# Altium schematic sheet 1_P1.schdoc.schdoc
size 309 x 223 mm; Symbol: Sheet-Symbol_A4; Device: Sheet-Symbol_A4; @Project Name: modula_2024; @Page Count: 1; @Update Date: 2024-04-04; @Create Date: 2024-04-02; @Schematic Name: Schematic1; @Page No: 1; @Page Name: P1; Company: EasyEDA.com; Reviewed: EasyEDA; Version: V0.1; Page Size: A4; Part Number: JLCPCB-002; Drawn: EasyEDA
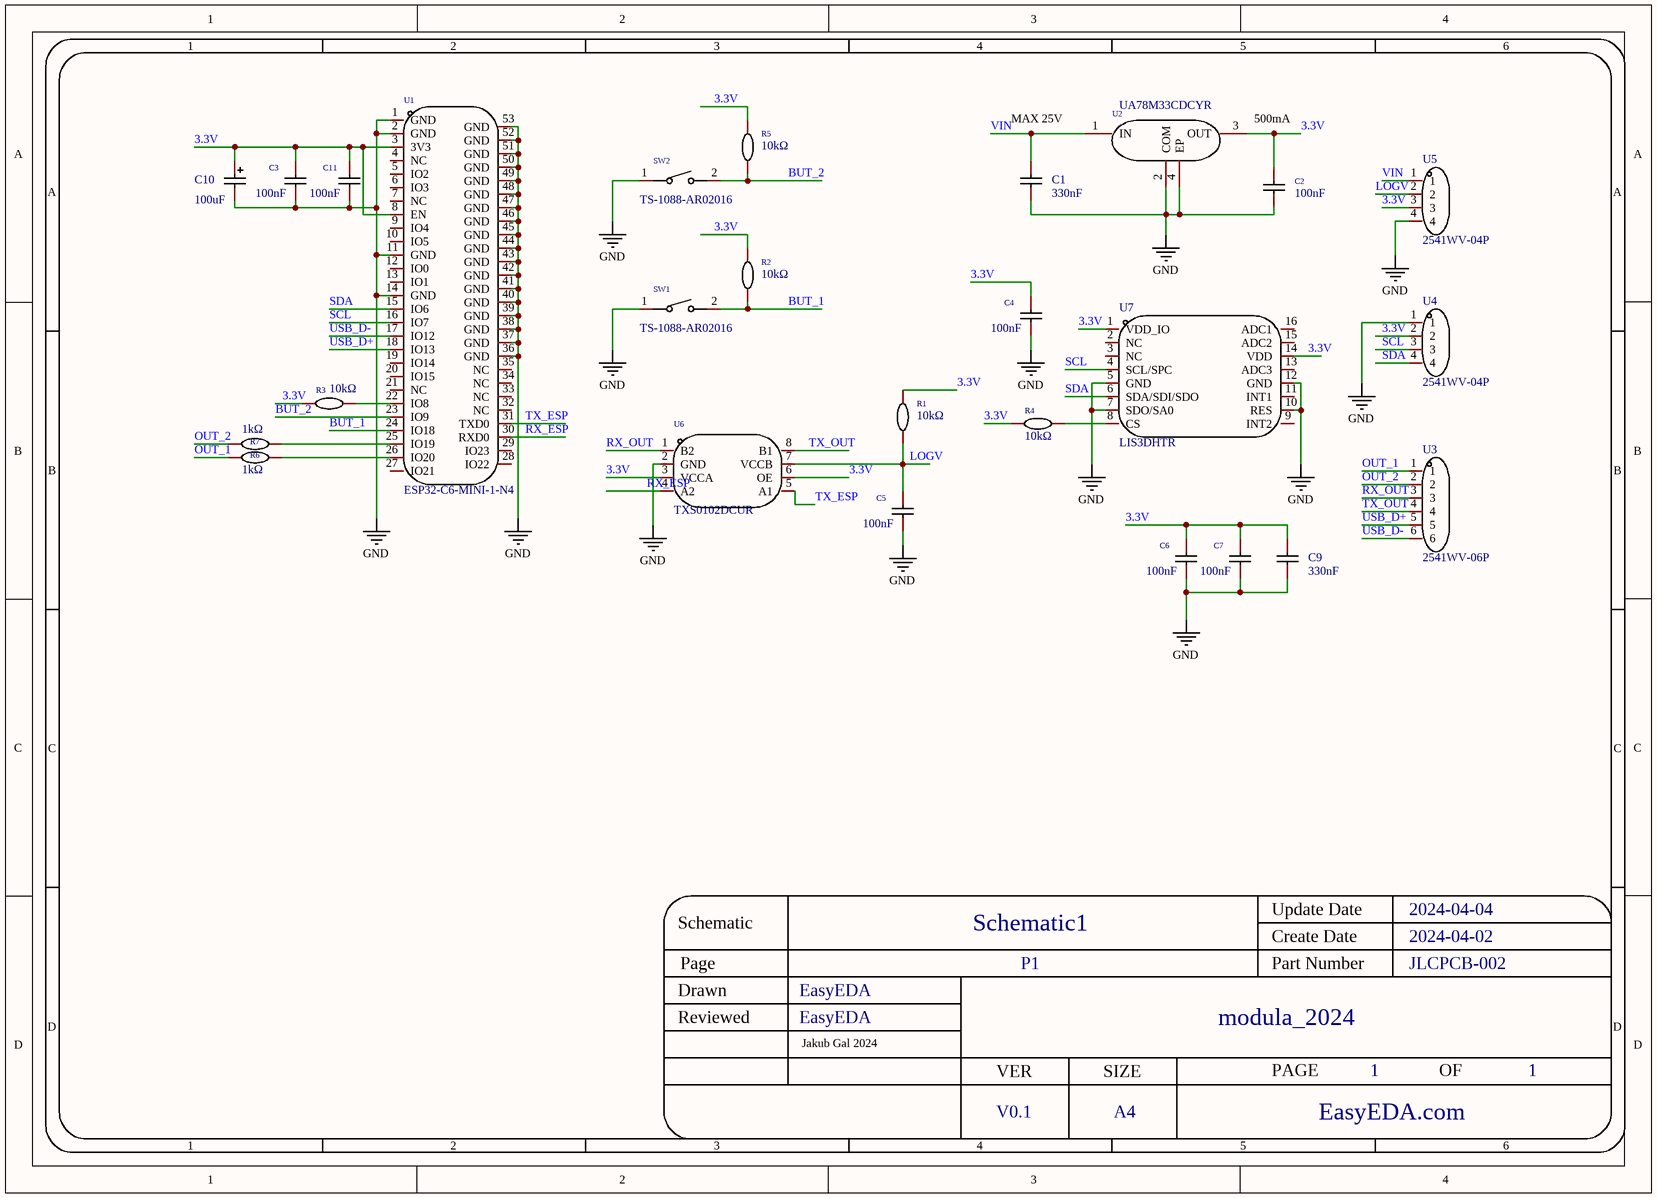
[diagram p0: 1_P1.schdoc.schdoc]

## Parts
C1  330nF  [C0805]
C2  100nF  [C0603]
C3  100nF  [C0603]
C4  100nF  [C0603]
C5  100nF  [C0603]
C6  100nF  [C0603]
C7  100nF  [C0603]
C9  330nF  [C0805]
C10  100uF  [CAP-SMD_L3.5-W2.8-R-RD]
C11  100nF  [C0603]
R1  10kΩ  [R0603]
R2  10kΩ  [R0603]
R3  10kΩ  [R0603]
R4  10kΩ  [R0603]
R5  10kΩ  [R0603]
R6  1kΩ  [R0603]
R7  1kΩ  [R0603]
SW1  TS-1088-AR02016  [SW-SMD_L3.9-W3.0-P4.45]
SW2  TS-1088-AR02016  [SW-SMD_L3.9-W3.0-P4.45]
U1  ESP32-C6-MINI-1-N4  [WIFIM-SMD_61P-L16.6-W13.2-P0.80-ESP32-C6-MINI-1-N4]
U2  UA78M33CDCYR  [SOT-223_L6.5-W3.5-P2.30-LS7.0-BR]
U3  2541WV-06P  [HDR-TH_6P-P2.54-V-M]
U4  2541WV-04P  [HDR-TH_4P-P2.54-V-M-1]
U5  2541WV-04P  [HDR-TH_4P-P2.54-V-M-1]
U6  TXS0102DCUR  [VSON8_L2.0-W2.3-P0.50-LS3.1-BL]
U7  LIS3DHTR  [LGA-16_L3.0-W3.0-P0.50-TL]

## Nets
GND: C1.1 C2.1 C3.1 C4.1 C5.1 C6.1 C7.1 C9.1 C10.2 C11.1 SW1.1 SW2.1 U1.1(GND) U1.2(GND) U1.11(GND) U1.14(GND) U1.36(GND) U1.37(GND) U1.38(GND) U1.39(GND) U1.40(GND) U1.41(GND) U1.42(GND) U1.43(GND) U1.44(GND) U1.45(GND) U1.46(GND) U1.47(GND) U1.48(GND) U1.49(GND) U1.50(GND) U1.51(GND) U1.52(GND) U1.53(GND) U2.2(COM) U2.4(EP) U4.1 U5.4 U6.2(GND) U7.5(GND) U7.7(SDO/SA0) U7.10(RES) U7.12(GND)
3.3V: C2.2 C3.2 C4.2 C6.2 C7.2 C9.2 C10.1 C11.2 R1.2 R2.2 R3.2 R4.2 R5.2 U1.3(3V3) U1.8(EN) U2.3(OUT) U4.2 U5.3 U6.3(VCCA) U6.6(OE) U7.1(VDD_IO) U7.14(VDD)
BUT_1: R2.1 SW1.2 U1.24(IO18)
BUT_2: R5.1 SW2.2 U1.23(IO9)
LOGV: C5.2 R1.1 U5.2 U6.7(VCCB)
OUT_1: R6.1 U3.1
OUT_2: R7.1 U3.2
RX_ESP: U1.30(RXD0) U6.4(A2)
RX_OUT: U3.3 U6.1(B2)
SCL: U1.16(IO7) U4.3 U7.4(SCL/SPC)
SDA: U1.15(IO6) U4.4 U7.6(SDA/SDI/SDO)
TX_ESP: U1.31(TXD0) U6.5(A1)
TX_OUT: U3.4 U6.8(B1)
USB_D+: U1.18(IO13) U3.5
USB_D-: U1.17(IO12) U3.6
VIN: C1.2 U2.1(IN) U5.1
NetR3_1: R3.1 U1.22(IO8)
NetR4_1: R4.1 U7.8(CS)
NetR6_2: R6.2 U1.26(IO20)
NetR7_2: R7.2 U1.25(IO19)

Not connected (* = marked no-connect by the designer): U1 4(NC) 5(IO2) 6(IO3) 7(NC) 9(IO4) 10(IO5) 12(IO0) 13(IO1) 19(IO14) 20(IO15) 21(NC) 27(IO21) 28(IO22) 29(IO23) 32(NC) 33(NC) 34(NC) 35(NC); U7 2(NC) 3(NC) 9(INT2) 11(INT1) 13(ADC3) 15(ADC2) 16(ADC1)

## Notes on the sheet
- MAX 25V
- 500mA
- Jakub Gal 2024
- 1
- 2
- 3
- 4
- 5
- 6
- A
- B
- C
- Schematic
- Schematic1
- Create Date
- Update Date
- 2024-04-04
- 2024-04-02
- Reviewed
- Drawn
- Page
- EasyEDA
- P1
- Part Number
- modula_2024
- JLCPCB-002
- D
- VER
- SIZE
- PAGE
- OF
- V0.1
- A4
- EasyEDA.com

## Library data of the parts
C1 C9 = 0805B334K500NT: Manufacturer: FH(风华); Add into BOM: yes; Tolerance: ±10%; Name: 330nF; Symbol: 0805B334K500NT; Device: 0805B334K500NT; LCSC Part Name: 330nF ±10% 50V; Supplier Part: C1740; Manufacturer Part: 0805B334K500NT; Supplier Footprint: 0805; JLCPCB Part Class: Extended Part; Datasheet: https://atta.szlcsc.com/upload/public/pdf/source/20200305/C486355_26A10D38EF8C2A5C37091D0039909270.pdf; Supplier: LCSC; Convert to PCB: yes; Value: 330nF
C2-C7 C11 = 0603B104K500NT_C30926: Manufacturer: FH(风华); Add into BOM: yes; Tolerance: ±10%; Name: 100nF; Symbol: 0603B104K500NT; Device: 0603B104K500NT_C30926; Supplier: LCSC; Manufacturer Part: 0603B104K500NT; Value: 100nF; Supplier Part: C30926; JLCPCB Part Class: Extended Part; LCSC Part Name: 100nF ±10% 50V; Supplier Footprint: 0603; Datasheet: https://atta.szlcsc.com/upload/public/pdf/source/20200305/C486355_26A10D38EF8C2A5C37091D0039909270.pdf; Convert to PCB: yes
C10 = CA45-B-6.3V-100uF-K: Manufacturer: CEC(振华新云); Add into BOM: yes; Tolerance: ±10%; Equivalent Series Resistance(ESR): 5Ω@100kHz; Name: 100uF; Symbol: CA45-B-6.3V-100UF-K; Device: CA45-B-6.3V-100uF-K; LCSC Part Name: 100uF ±10% 6.3V; Supplier Part: C129289; Manufacturer Part: CA45-B-6.3V-100uF-K; Supplier Footprint: CASE-B-3528; JLCPCB Part Class: Extended Part; Datasheet: https://atta.szlcsc.com/upload/public/pdf/source/20170914/C129289_1505359937328968145.pdf; Supplier: LCSC; Convert to PCB: yes; Value: 100uF; Operating Temperature: -55℃~+125℃
R1-R5 = 0603WAF1002T5E: Manufacturer: UNI-ROYAL(厚声); Add into BOM: yes; Tolerance: ±1%; Temperature Coefficient: ±100ppm/℃; Name: 10kΩ; Symbol: 0603WAF1002T5E; Device: 0603WAF1002T5E; Supplier: LCSC; Manufacturer Part: 0603WAF1002T5E; Supplier Part: C25804; Value: 10kΩ; JLCPCB Part Class: Basic Part; LCSC Part Name: 厚膜电阻 10kΩ ±1% 100mW; Supplier Footprint: 0603; Datasheet: https://atta.szlcsc.com/upload/public/pdf/source/20200306/C422600_1E6D84923E4A46A82E41ADD87F860B5C.pdf; Convert to PCB: yes; Type: Thick Film Resistors; Operating Temperature Range: -55℃~+155℃
R6 R7 = 0603WAJ0102T5E: Manufacturer: UNI-ROYAL(厚声); Add into BOM: yes; Tolerance: ±5%; Temperature Coefficient: ±100ppm/℃; Name: 1kΩ; Symbol: 0603WAJ0102T5E; Device: 0603WAJ0102T5E; Supplier: LCSC; Manufacturer Part: 0603WAJ0102T5E; Supplier Part: C25585; Value: 1kΩ; JLCPCB Part Class: Extended Part; LCSC Part Name: 1kΩ ±5% 100mW 厚膜电阻; Supplier Footprint: 0603; Datasheet: https://atta.szlcsc.com/upload/public/pdf/source/20200306/C422600_1E6D84923E4A46A82E41ADD87F860B5C.pdf; Convert to PCB: yes; Type: Thick Film Resistors; Operating Temperature Range: -55℃~+155℃
SW1 SW2 = TS-1088-AR02016: Manufacturer: XUNPU(讯普); Add into BOM: yes; Circuit: SPST; Actuator Style: Round Button; Operating Force: 160gf; Switch Length: 4mm; Switch Width: 3mm; Switch Height: 2mm; Strike Gundam: 不带; Contact Current: 50mA; Voltage Rating (DC): 12V; Insulation Resistance: 100MΩ; Actuator/Cap Color: Black; Pin Style: SMDSplicing; Mechanical Life: 10万次; Name: TS-1088-AR02016; Symbol: TS-1088-AR02016; Device: TS-1088-AR02016; Supplier: LCSC; Supplier Part: C720477; Manufacturer Part: TS-1088-AR02016; JLCPCB Part Class: Extended Part; LCSC Part Name: 4*3*2mm 立贴 轻触开关; Supplier Footprint: SMD; Datasheet: https://atta.szlcsc.com/upload/public/pdf/source/20200810/C720475_60D09DD6C54279ADDB2DC25100F1CC11.pdf; Convert to PCB: yes; Mounting Style: Brick nogging; Operating Temperature: -30℃~+80℃
U1 = ESP32-C6-MINI-1-N4: Manufacturer: ESPRESSIF(乐鑫); Add into BOM: yes; Name: ESP32-C6-MINI-1-N4; Symbol: ESP32-C6-MINI-1-N4; Device: ESP32-C6-MINI-1-N4; Supplier: LCSC; Supplier Part: C5736265; Manufacturer Part: ESP32-C6-MINI-1-N4; JLCPCB Part Class: Extended Part; LCSC Part Name: ESP32-C6-MINI-1-N4; Supplier Footprint: SMD-53P; Datasheet: https://atta.szlcsc.com/upload/public/pdf/source/20240130/4529D418EFEC832950EB8101798FAED6.pdf; Convert to PCB: yes
U2 = UA78M33CDCYR: Manufacturer: TI(德州仪器); Add into BOM: yes; Maximum Input Voltage: 25V; Output Voltage: 3.3V; MAX Output Current: 500mA; Power Supply Rejection Ratio (PSRR): 80dB@(120Hz); Dropout Voltage: 2V@(350mA); Output Polarity: Positive electrode; Number of Outputs: 1; Name: UA78M33CDCYR; Symbol: UA78M33CDCYR; Device: UA78M33CDCYR; Supplier: LCSC; Manufacturer Part: UA78M33CDCYR; Supplier Part: C49036; JLCPCB Part Class: Extended Part; LCSC Part Name: 输入25V 输出3.3V 500mA; Supplier Footprint: SOT-223; Datasheet: https://www.ti.com/cn/lit/gpn/ua78m; Convert to PCB: yes; Operating Temperature: 0℃~+125℃
U3 = 2541WV-06P: Manufacturer: HanElectricity(瀚源); Add into BOM: yes; Pitch: 2.54mm; Name: 2541WV-06P; Symbol: 2541WV-06P; Device: 2541WV-06P; LCSC Part Name: 2541WV-06P; Supplier Part: C5383115; Manufacturer Part: 2541WV-06P; Supplier Footprint: 插件,P=2.54mm; JLCPCB Part Class: Extended Part; Datasheet: https://atta.szlcsc.com/upload/public/pdf/source/20230330/2BC52F76E32B2D45ECCE68ADA82449DD.pdf; Supplier: LCSC; Convert to PCB: yes; Mounting Type: Straight; Number of Rows: Plugin; Length of Mating Pin: 6mm; Insulation Height: 2.54mm; Length of End Connection Pin: 3mm
U4 U5 = 2541WV-04P: Manufacturer: HanElectricity(瀚源); Add into BOM: yes; Pitch: 2.54mm; Name: 2541WV-04P; Symbol: 2541WV-04P; Device: 2541WV-04P; LCSC Part Name: 2541WV-04P; Supplier Part: C5383113; Manufacturer Part: 2541WV-04P; Supplier Footprint: 插件,P=2.54mm; Datasheet: https://atta.szlcsc.com/upload/public/pdf/source/20230330/2BC52F76E32B2D45ECCE68ADA82449DD.pdf; Supplier: LCSC; Convert to PCB: yes; Mounting Type: Straight; Number of Rows: Plugin; Length of Mating Pin: 6mm; Insulation Height: 2.54mm; Length of End Connection Pin: 3mm
U6 = TXS0102DCUR: Manufacturer: TI(德州仪器); Add into BOM: yes; Channel Type: Bi-Directional; Data Rate: 24Mbps; Supply Voltage (VCCA): 1.65V~3.6V; Supply Voltage (VCCB): 2.3V~5.5V; Number of Circuits: 1; Channels per Circuit: 2; Output Type: Open Drain；Push-pull; Name: TXS0102DCUR; Symbol: TXS0102DCUR; Device: TXS0102DCUR; Supplier: LCSC; Manufacturer Part: TXS0102DCUR; Supplier Part: C53434; JLCPCB Part Class: Extended Part; LCSC Part Name: 24Mbps 2位双向电平转换器; Supplier Footprint: VSSOP-8; Datasheet: https://www.ti.com/cn/lit/gpn/txs0102; Convert to PCB: yes; Input Signal: -; Output Signal: -; Operating Temperature: -40℃~+85℃; Features: 自动方向检测
U7 = LIS3DHTR: Manufacturer: ST(意法半导体); Symbol: LIS3DHTR_C15134; Add into BOM: yes; Axial Direction: X,Y,Z; Supply Voltage: 1.71V~3.6V; Name: LIS3DHTR; Device: LIS3DHTR; LCSC Part Name: LIS3DHTR; Supplier Part: C15134; Manufacturer Part: LIS3DHTR; Supplier Footprint: LGA-16(3x3); JLCPCB Part Class: Extended Part; Datasheet: https://atta.szlcsc.com/upload/public/pdf/source/20170502/1493709336456.pdf; Supplier: LCSC; Convert to PCB: yes; Operating Temperature: -40℃~+85℃